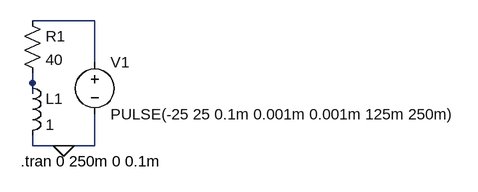
[diagram p0: schematic 3.asc]
3.asc, the LTspice schematic file:
Version 4
SHEET 1 880 680
WIRE 64 -112 -32 -112
WIRE 64 -48 64 -112
WIRE -32 -16 -32 -32
WIRE -32 0 -32 -16
WIRE -32 80 -32 64
WIRE 16 80 -32 80
WIRE 64 80 64 32
WIRE 64 80 16 80
FLAG 16 80 0
SYMBOL res -48 -128 R0
SYMATTR InstName R1
SYMATTR Value 40
SYMBOL voltage 64 -64 R0
WINDOW 123 0 0 Left 0
WINDOW 39 0 0 Left 0
SYMATTR InstName V1
SYMATTR Value PULSE(-25 25 0.1m 0.001m 0.001m 125m 250m)
SYMBOL ind -48 -32 R0
SYMATTR InstName L1
SYMATTR Value 1
TEXT -50 104 Left 2 !.tran 0 250m 0 0.1m

The netlist it stands for:
* 3.asc
R1 N001 N002 40
V1 N001 0 PULSE(-25 25 0.1m 0.001m 0.001m 125m 250m)
L1 N002 0 1
.tran 0 250m 0 0.1m
.backanno
.end